# Altium schematic sheet High_Voltage_Driver.SchDoc
size A; CompanyName: Microchip Technology Inc.; Organization: Microchip Technology; Address1: 2355 West Chandler Blvd.; Address2: Chandler, AZ  85224; Address4: USA; SheetNumber: 1; SheetTotal: 1; Time: Time
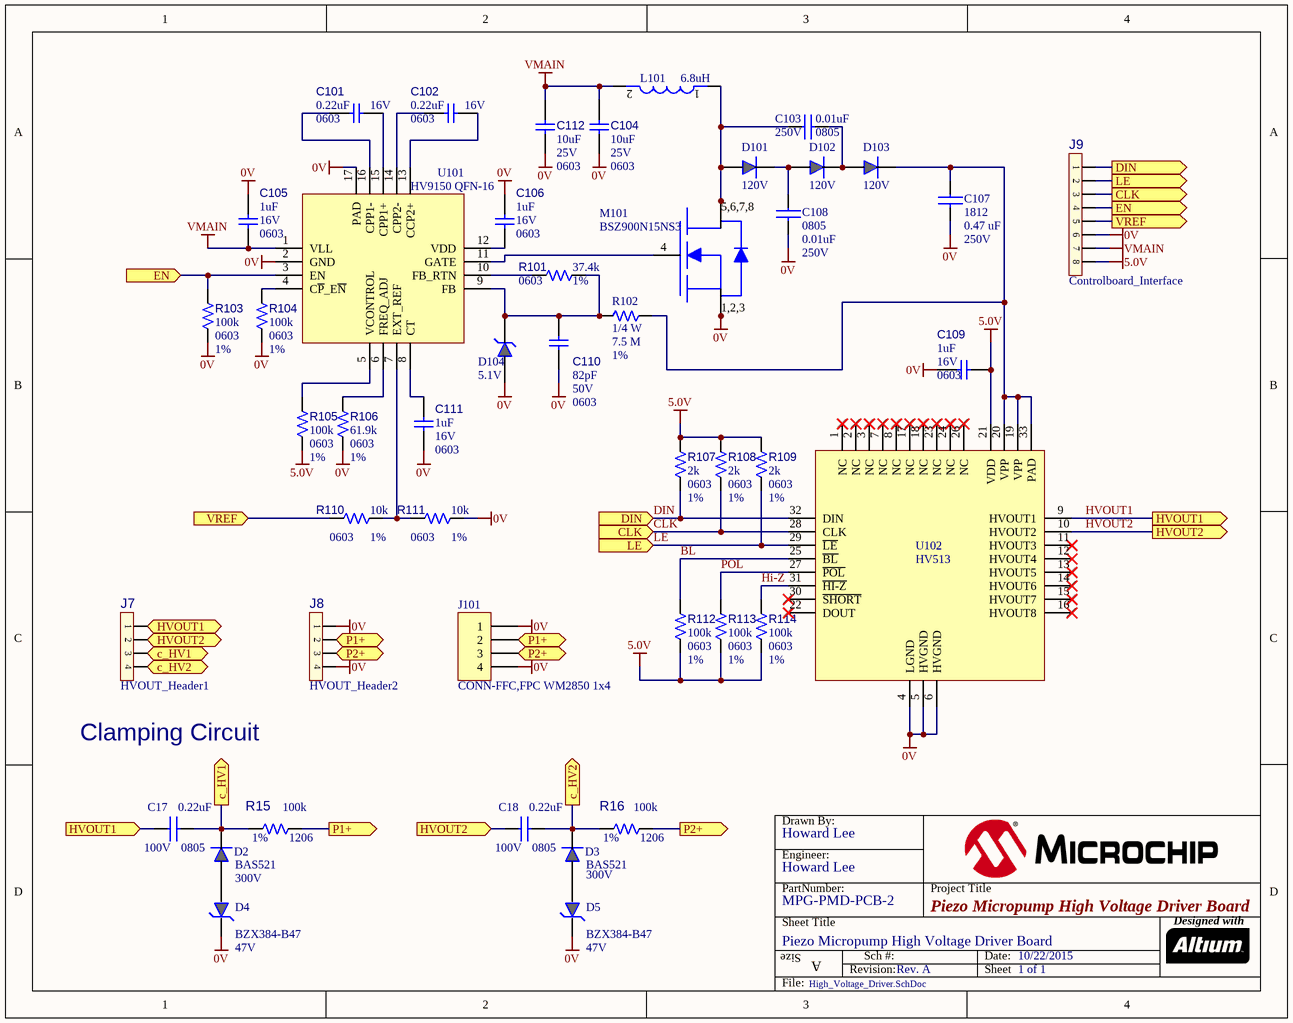
[diagram p0: High_Voltage_Driver.SchDoc]

## Parts
?  (no value)  (graphical)
C17  value 0.22uF  Voltage: 100V  [0805]  (hidden comment: Capacitor 0.22uF 100V 0805)
C18  value 0.22uF  Voltage: 100V  [0805]  (hidden comment: Capacitor 0.22uF 100V 0805)
C101  value 0.22uF  Voltage: 16V  Package: 0603  [CAP_C_0603]  (hidden comment: Capacitor NP)
C102  value 0.22uF  Voltage: 16V  Package: 0603  [CAP_C_0603]  (hidden comment: Capacitor NP)
C103  value 0.01uF  Voltage: 250V  [0805]  (hidden comment: Capacitor 0.01uF 250V 0805)
C104  value 10uF  Voltage: 25V  Package: 0603  [CAP_C_0603]  (hidden comment: Capacitor NP)
C105  value 1uF  Voltage: 16V  Package: 0603  [CAP_C_0603]  (hidden comment: Capacitor NP)
C106  value 1uF  Voltage: 16V  Package: 0603  [CAP_C_0603]  (hidden comment: Capacitor NP)
C107  value 0.47 uF  Voltage: 250V  [1812]  (hidden comment: Capacitor 0.47uF 250V 1812)
C108  value 0.01uF  Voltage: 250V  [0805]  (hidden comment: Capacitor 0.01uF 250V 0805)
C109  value 1uF  Voltage: 16V  Package: 0603  [CAP_C_0603]  (hidden comment: Capacitor NP)
C110  value 82pF  Voltage: 50V  Package: 0603  [CAP_C_0603]  (hidden comment: Capacitor NP)
C111  value 1uF  Voltage: 16V  Package: 0603  [CAP_C_0603]  (hidden comment: Capacitor NP)
C112  value 10uF  Voltage: 25V  Package: 0603  [CAP_C_0603]  (hidden comment: Capacitor NP)
D2  Part Number: BAS521  [SC-79]  (hidden comment: 300V)
D3  Part Number: BAS521  [SC-79]  (hidden comment: 300V)
D4  Part Number: BZX384-B47  [SOD-323]  (hidden comment: 47V)
D5  Part Number: BZX384-B47  [SOD-323]  (hidden comment: 47V)
D101  120V  [SOD-923]
D102  120V  [SOD-923]
D103  120V  [SOD-923]
D104  5.1V  [SSSMini2-F4-B]
J7  HVOUT_Header1  [HDR_F_2.54_1x4_RA]
J8  HVOUT_Header2  [HDR_F_2.54_1x4_RA]
J9  Controlboard_Interface  [HDR_F_2.54_1x8_RA]
J101  CONN-FFC,FPC WM2850 1x4  [FFC - MOLEX 0039532044]
L101  Inductance: 6.8uH  [Inductor-W-0.1uH]  (hidden comment: Inductor 6.8uH  Wurth WE LHMI)
M101  BSZ900N15NS3  [PG-TSDSON-8]
R15  value 100k  Package: 1206  Tolerance: 1%  [RES_C_1206]  (hidden comment: Resistor)
R16  value 100k  Package: 1206  Tolerance: 1%  [RES_C_1206]  (hidden comment: Resistor)
R101  value 37.4k  Package: 0603  Tolerance: 1%  [RES_C_0603]  (hidden comment: Resistor)
R102  value 7.5 M  Power: 1/4 W  Tolerance: 1%  [RES 7.5M SMD 1206]  (hidden comment: 1206 500V Resistor)
R103  value 100k  Package: 0603  Tolerance: 1%  [RES_C_0603]  (hidden comment: Resistor)
R104  value 100k  Package: 0603  Tolerance: 1%  [RES_C_0603]  (hidden comment: Resistor)
R105  value 100k  Package: 0603  Tolerance: 1%  [RES_C_0603]  (hidden comment: Resistor)
R106  value 61.9k  Package: 0603  Tolerance: 1%  [RES_C_0603]  (hidden comment: Resistor)
R107  value 2k  Package: 0603  Tolerance: 1%  [RES_C_0603]  (hidden comment: Resistor)
R108  value 2k  Package: 0603  Tolerance: 1%  [RES_C_0603]  (hidden comment: Resistor)
R109  value 2k  Package: 0603  Tolerance: 1%  [RES_C_0603]  (hidden comment: Resistor)
R110  value 10k  Package: 0603  Tolerance: 1%  [RES_C_0603]  (hidden comment: Resistor)
R111  value 10k  Package: 0603  Tolerance: 1%  [RES_C_0603]  (hidden comment: Resistor)
R112  value 100k  Package: 0603  Tolerance: 1%  [RES_C_0603]  (hidden comment: Resistor)
R113  value 100k  Package: 0603  Tolerance: 1%  [RES_C_0603]  (hidden comment: Resistor)
R114  value 100k  Package: 0603  Tolerance: 1%  [RES_C_0603]  (hidden comment: Resistor)
U101  HV9150 QFN-16  [QFN-16(3X3)]
U102  HV513  [QFN-32(6X6)]

## Ports
c_HV1 (in), c_HV1 (out), c_HV2 (in), c_HV2 (out), CLK (in), CLK (out), DIN (in), DIN (out), EN (in), EN (out), HVOUT1 (in), HVOUT1 (out), HVOUT2 (in), HVOUT2 (out), LE (in), LE (out), P1+ (in), P1+ (out), P2+ (in), P2+ (out), VREF (in), VREF (out)

## Nets
0V: C104.1 C105.2 C106.2 C107.2 C108.2 C109.1 C110.1 C111.1 C112.1 D4.1 D5.1 D104.2 J8.1 J8.4 J9.6 J101.1 J101.4 M101.1 M101.2 M101.3 R103.1 R104.1 R106.1 R111.1 U101.2(GND) U101.17(PAD) U102.4(LGND) U102.5(HVGND) U102.6(HVGND)
5.0V: C109.2 J9.8 R105.1 R107.2 R108.2 R109.2 R112.2 R113.1 R114.1 U102.21(VDD)
VMAIN: C104.2 C105.1 C112.2 J9.7 L101.2 U101.1(VLL)
BL: R112.1 U102.25(~{BL})
c_HV1: C17.2 D2.1 J7.3 R15.1 ; port c_HV1
c_HV2: C18.2 D3.1 J7.4 R16.1 ; port c_HV2
CLK: J9.3 R108.1 U102.28(CLK) ; port CLK
DIN: J9.1 R107.1 U102.32(DIN) ; port DIN
EN: J9.4 R103.2 U101.3(EN) ; port EN
Hi-Z: R114.2 U102.31(~{HI-Z})
HVOUT1: C17.1 J7.1 U102.9(HVOUT1) ; port HVOUT1
HVOUT2: C18.1 J7.2 U102.10(HVOUT2) ; port HVOUT2
LE: J9.2 R109.1 U102.29(~{LE}) ; port LE
P1+: J8.2 J101.2 R15.2 ; port P1+
P2+: J8.3 J101.3 R16.2 ; port P2+
POL: R113.2 U102.27(~{POL})
VREF: J9.5 R110.1 ; port VREF
NetC101_1: C101.1 U101.15(CPP1+)
NetC101_2: C101.2 U101.16(CPP1-)
NetC102_1: C102.1 U101.14(CPP2-)
NetC102_2: C102.2 U101.13(CCP2+)
NetC103_1: C103.1 D101.2 L101.1 M101.5 M101.6 M101.7 M101.8
NetC103_2: C103.2 D102.1 D103.2
NetC106_1: C106.1 U101.12(VDD)
NetC107_1: C107.1 D103.1 R102.2 U102.19(VPP) U102.20(VPP) U102.33(PAD)
NetC108_1: C108.1 D101.1 D102.2
NetC110_2: C110.2 D104.1 R101.2 R102.1 U101.9(FB)
NetC111_2: C111.2 U101.8(CT)
NetD2_2: D2.2 D4.2
NetD3_2: D3.2 D5.2
NetM101_4: M101.4 U101.11(GATE)
NetR101_1: R101.1 U101.10(FB_RTN)
NetR104_2: R104.2 U101.4(C~{P}_E~{N})
NetR105_2: R105.2 U101.5(VCONTROL)
NetR106_2: R106.2 U101.6(FREQ_ADJ)
NetR110_2: R110.2 R111.2 U101.7(EXT_REF)

Not connected (* = marked no-connect by the designer): U102 1(NC)* 2(NC)* 3(NC)* 7(NC)* 8(NC)* 11(HVOUT3)* 12(HVOUT4)* 13(HVOUT5)* 14(HVOUT6)* 15(HVOUT7)* 16(HVOUT8)* 17(NC)* 18(NC)* 22(DOUT)* 23(NC)* 24(NC)* 26(NC)* 30(~{SHORT})*

## Notes on the sheet
- Clamping Circuit
- Drawn By:
- Howard Lee
- Engineer:
- MPG-PMD-PCB-2
- PartNumber:
- Piezo Micropump High Voltage Driver Board
- Project Title
- Sheet Title
- Size
- A
- Revision:
- Sch #:
- Rev. A
- Date:
- Sheet
- 10/22/2015
- Designed with
- File:
- (in symbol BSZ900N15NS3) 5,6,7,8; 1,2,3

## Library data of the parts
? = Title Block A
C17 C18 = Capacitor 0.22uF 100V 0805: Manufacturer1: Kemet; Part Number: C0805C224K1RACAUTO; Type: Ceramic; Tolerance: +/-10%; Manufacturer: Kemet; PackageDescription: Chip Package; Supplier 1: Digikey; Supplier Part Number 1: 399-6946-1-ND; Package: 0805
C101 C102 = CAP1295: Capacitor; Manufacturer 1: TDK Corporation; Manufacturer Part Number 1: C1608X7R1C224K080AC; Description_: CAP CER 0.22uF 16V 10% X7R SMD 0603; Tolerance: 10%; Temperature Coeffcient: X7R; Type: Ceramic; Owner: Jairuz Agang-ang; Populated: YES; MCHP-ID: CAP1295; Revision: 1; Status: Production; ComponentLink1URL: https://chn-vm-apps.microchip.com/mchprepo/parts/Datasheets/mlccspec_commercial_general_midvoltage_en.pdf; ComponentLink1Description: Datasheet; Operating Temperature: -55C to +125C; Category: Capacitor; Supplier 1: Digi-Key; Supplier Part Number 1: 445-1318-1-ND; Quantity Override: 1
C103 C108 = Capacitor 0.01uF 250V 0805: Manufacturer1: TDK; Part Number: C2012X7R2E103K125AA; Type: Ceramic; Manufacturer: TDK; PackageDescription: Chip Package; Supplier 1: Digikey; Supplier Part Number 1: 445-2280-1-ND; Package: 0805
C104 C112 = CAP1461: Capacitor; Manufacturer 1: Murata Electronics North America; Manufacturer Part Number 1: GRM188R61E106MA73D; Description_: CAP CER 10UF 25V 20% X5R SMD 0603; Tolerance: ±20%; Temperature Coeffcient: X5R; Type: Ceramic; Owner: Tim Moffat; Populated: YES; MCHP-ID: CAP1461; Revision: 1; Status: Production; ComponentLink1URL: https://chn-vm-apps.microchip.com/mchprepo/parts/Datasheets/GRM188R61E106MA73-01.pdf; ComponentLink1Description: Datasheet; Operating Temperature: -55C to 85C; Category: Capacitor; Supplier 1: Digi-Key; Supplier Part Number 1: 490-7202-1-ND; Quantity Override: 1
C105 C106 C109 C111 = CAP0517: Capacitor; Manufacturer 1: Taiyo Yuden; Manufacturer Part Number 1: EMK107B7105KA-T; Description_: CAP CER 1uF 16V 10% X7R SMD 0603; Tolerance: 10%; Temperature Coeffcient: X7R; Type: Ceramic; Populated: Yes; MCHP-ID: CAP0517; Revision: 1; Status: Production; ComponentLink1URL: https://chn-vm-apps.microchip.com/mchprepo/parts/Datasheets/mlcc01_e.pdf; ComponentLink1Description: Datasheet; Operating Temperature: -55C to +125C; Category: Capacitor; Manufacturer 2: TDK; Manufacturer Part Number 2: C1608X7R1C105K; Supplier 1: Digi-Key; Supplier Part Number 1: 587-1241-1-ND; Supplier 2: Digi-Key; Supplier Part Number 2: 445-1604-1-ND; Quantity Override: 1
C107 = Capacitor 0.47uF 250V 1812: Manufacturer1: Murata; Part Number: GRM43DR72E474KW01L; Type: Ceramic; Manufacturer: Murata; PackageDescription: Chip Package; Supplier 1: Digikey; Supplier Part Number 1: 490-3549-6-ND; Package: 1812
C110 = CAP1424: Capacitor; Manufacturer 1: Murata Electronics North America; Manufacturer Part Number 1: GRM1885C1H820JA01D; Description_: CAP CER 82pF 50V 5% NP0 SMD 0603; Tolerance: 5%; Temperature Coeffcient: NP0; Type: Ceramic; Owner: Tad Ahlvers; Populated: YES; MCHP-ID: CAP1424; Revision: B; Status: Design; ComponentLink1URL: https://chn-vm-apps.microchip.com/mchprepo/parts/Datasheets/GRM1885C1H820JA01-01.pdf; ComponentLink1Description: Datasheet; Operating Temperature: -55C to +125C; Category: Capacitor; Supplier 1: Digi-Key; Supplier Part Number 1: 490-1425-1-ND; Quantity Override: 1
D2 D3 = Diode-BAS521-50ns-300V: BAS521- Single high-voltage switching diode 300V; Manufacturer: NXP Semiconductors; LeadCount: 2; TempRange: -65C to  150C; Reverse recovery time: 50ns; Forward Current: 250mA; Package: SC-79; PackageType: SC-79; Power: -; Supplier 1: Digikey; Supplier Part Number 1: 568-6009-1-ND; Voltage: 300V
D4 D5 = ZenerDiode-47V: Zener Diode 47V - BZX384-B47 - Voltage regulator diode +/-2%; Manufacturer: NXP Semiconductors; LeadCount: 2; Power: 300mW; TempRange: -65C to  150C; Forward Current: 250mA; Package: SOD-323; PackageType: SOD-323; Tolerance: +/-2%; Supplier 1: Digikey; Supplier Part Number 1: 568-3830-1-ND; Reverse recovery time: -; Voltage: 47V
D101-D103 = Diode-Ultra Fast Speed-4ns-120V: Manufacturer: Central Semiconductro Corp; Part Number: CMAD4448 CT-ND; LeadCount: 2; TempRange: -65C to  150C; Tolerance: +/- 5%; Package: SOD-923; PackageType: SOD-923; Power: -; Voltage: 120V; Supplier 1: Digikey; Supplier Part Number 1: CMAD4448 CT-ND
D104 = ZenerDiode_5.1V [SSSMini2-F4-B]: ZenerDiode 5.1V; Manufacturer: Micro Commercial Co; Part Number: DZ2705100LTR-ND; LeadCount: 2; Power: 120mW; TempRange: -40C to  85C; Tolerance: +/- 5%; Package: SSSMini2-F4-B; PackageType: 2-SMD; Voltage: 5.1V; Supplier 1: Digikey; Supplier Part Number 1: DZ2705100LTR-ND
J7 J8 = CON1287: Manufacturer 1: Samtec Inc; Manufacturer Part Number 1: SSW-104-02-G-S-RA; Value: HDR-2.54 Female 1x4; Description_: CON HDR-2.54 Female 1x4 Gold TH R/A; Owner: Bogdan Popescu; Populated: YES; MCHP-ID: CON1287; Revision: A; Status: Design; ComponentLink1URL: https://chn-vm-apps.microchip.com/mchprepo/parts/Datasheets/SSW-1XX-XX-XXX-X-XX-XXX-XX-MKT.pdf; ComponentLink1Description: Datasheet; Type: Header 2.54mm; Category: Connector; Supplier 1: Digi-Key; Supplier Part Number 1: SAM1225-04-ND; Quantity Override: 1
J9 = CON1288: Manufacturer 1: Sullins Connector Solutions; Manufacturer Part Number 1: PPPC081LGBN-RC; Value: HDR-2.54 Female 1x8; Description_: CON HDR-2.54 Female 1x8 Gold TH R/A; Owner: Bogdan Popescu; Populated: YES; MCHP-ID: CON1288; Revision: A; Status: Design; ComponentLink1URL: https://chn-vm-apps.microchip.com/mchprepo/parts/Datasheets/78_P(N)PxCxx1LGBN-RC,_10493-F.pdf; ComponentLink1Description: Datasheet; Type: Header 2.54mm; Category: Connector; Supplier 1: Digi-Key; Supplier Part Number 1: S5483-ND; Quantity Override: 1
J101 = CONN-FFC,FPC TOP4POS 1.25MM RA 1x4: Manufacturer1: MOLEX; Part Number: 0039532044; LeadCount: 4; Category: MCHP-Analog; PackageType: Flat Flex Connnector; Manufacturer: MOLEX; Supplier: Digikey; Supplier 1: Digikey; Supplier Part Number 1: WM2850-ND
L101 = Inductor 6.8uH  Wurth WE LHMI: Inductor-6.8uH Wurth WE LHMI SMD Low Profile High Current Molded Inductor; Part Number: 744 373 240 68; Manufacturer: Wurth Elektronik
M101 = BSZ900N15NS3: Power Transistor-150V; Manufacturer1: Infineon Technologies; Part Number: BSZ900N15NS3 GTR-ND; Voltage: 150V; Manufacturer: Infineon Technologies; Operating Temperature: -55 to +150 C; Package: 8-PowerTDFN; PackageType: PG-TSDSON-8; Supplier 1: Digikey; Supplier Part Number 1: BSZ900N15NS3 GTR-ND
R15 R16 = RES1231: Manufacturer 1: Panasonic; Manufacturer Part Number 1: ERJ-8ENF1003V; Description_: RES TKF 100k 1% 1/4W SMD 1206; Voltage: 200V; Temperature Coeffcient: 100ppm/C; Power: 1/4W; Owner: Bogdan P (M91398); Populated: Yes; MCHP-ID: RES1231; Revision: 0; Status: Production; ComponentLink1URL: https://chn-vm-apps.microchip.com/mchprepo/parts/Datasheets/AOA0000CE2.pdf; ComponentLink1Description: Datasheet; Operating Temperature: -55C to +155C; Category: Resistor; Type: RES SMD; Composition: TKF; Supplier 1: Digi-Key; Supplier Part Number 1: P100KFCT-ND; Quantity Override: 1
R101 = RSMT0489: Manufacturer 1: Panasonic; Manufacturer Part Number 1: ERJ-3EKF3742V; Description_: RES TKF 37.4k 1% 1/10W SMD 0603; Voltage: 75V; Temperature Coeffcient: 100ppm/C; Power: 1/10W; Populated: Yes; MCHP-ID: RSMT0489; Revision: 1; Status: Production; ComponentLink1URL: https://chn-vm-apps.microchip.com/mchprepo/parts/Datasheets/AOA0000CE2.pdf; ComponentLink1Description: Datasheet; Operating Temperature: -55C to +155C; Category: Resistor; Type: RES SMD; Composition: TKF; Supplier 1: Digi-Key; Supplier Part Number 1: P37.4KHTR-ND; Quantity Override: 1
R102 = Resistor-7.5M_[1206]: Resistor-7.5M; Manufacturer: ROHM Semiconductors; Part Number: RHM 7.5M AICT-ND; Temperature Coefficient: +/- 100ppm/C; Suplier1: Digi-Key; PackageDescription: Chip Package; Voltage: 500V; Package: 1206; Type: RES SMD; Operating Temperature: -55 to +155 C; Supplier 1: Digikey; Supplier Part Number 1: RHM 7.5M AICT-ND
R103-R105 R112-R114 = RES1066: Manufacturer 1: Vishay; Manufacturer Part Number 1: MCT06030C1003FP500; Description_: RES TF 100k 1% 1/8W SMD 0603; Voltage: 75V; Temperature Coeffcient: 50ppm/C; Power: 1/8W; Owner: Tad Ahlvers; Populated: Yes; MCHP-ID: RES1066; Revision: 1; Status: Production; ComponentLink1URL: https://chn-vm-apps.microchip.com/mchprepo/parts/Datasheets/mc_pro.pdf; ComponentLink1Description: Datasheet; Operating Temperature: -55C to +155C; Category: Resistor; Type: RES SMD; Composition: TF; Supplier 1: Digi-Key; Supplier Part Number 1: MCT0603-100K-CFTR-ND; Quantity Override: 1
R106 = RSMT0411: Manufacturer 1: Panasonic; Manufacturer Part Number 1: ERJ-3EKF6192V; Description_: RES TKF 61.9k 1% 1/10W SMD 0603; Voltage: 75V; Temperature Coeffcient: 100ppm/C; Power: 1/10W; Populated: Yes; MCHP-ID: RSMT0411; Revision: 1; Status: Production; ComponentLink1URL: https://chn-vm-apps.microchip.com/mchprepo/parts/Datasheets/AOA0000CE2.pdf; ComponentLink1Description: Datasheet; Operating Temperature: -55C to +155C; Category: Resistor; Type: RES SMD; Composition: TKF; Manufacturer 2: ROHM; Manufacturer Part Number 2: MCR03EZPFX6192; Manufacturer 3: Stackpole Electronics Inc; Manufacturer Part Number 3: RMCF 1/16 61.9K 1% R; Manufacturer 4: Stackpole Electronics Inc; Manufacturer Part Number 4: RMCF0603FT61K9; Supplier 1: Digi-Key; Supplier Part Number 1: P61.9KHCT-ND; Supplier 2: Digi-Key; Supplier Part Number 2: RHM61.9KHCT-ND; Supplier 3: Digi-Key; Supplier Part Number 3: RMCF0603FT61K9TR-ND; Supplier 4: Digi-Key; Supplier Part Number 4: RMCF1/1661.9KFRTR-ND; Quantity Override: 1
R107-R109 = RSMT0382: Manufacturer 1: Panasonic; Manufacturer Part Number 1: ERJ-3EKF2001V; Description_: RES TKF 2k 1% 1/10W SMD 0603; Voltage: 75V; Temperature Coeffcient: 100ppm/C; Power: 1/10W; Populated: Yes; MCHP-ID: RSMT0382; Revision: 1; Status: Production; ComponentLink1URL: https://chn-vm-apps.microchip.com/mchprepo/parts/Datasheets/AOA0000CE2.pdf; ComponentLink1Description: Datasheet; Operating Temperature: -55C to +155C; Category: Resistor; Type: RES SMD; Composition: TKF; Supplier 1: Digi-Key; Supplier Part Number 1: P2.00KHTR-ND; Supplier 2: Digi-Key; Supplier Part Number 2: P2.00KHCT-ND; Quantity Override: 1
R110 R111 = RES1368: Manufacturer 1: TE Connectivity; Manufacturer Part Number 1: 5-1879337-9; Description_: RES TF 10k 1% 1/16W SMD 0603; Voltage: 100V; Temperature Coeffcient: 50ppm/C; Circuit Type: Isolated; Power: 1/16W; Owner: Jairuz Agang-ang; Populated: YES; MCHP-ID: RES1368; Revision: 1; Status: Production; ComponentLink1URL: https://chn-vm-apps.microchip.com/mchprepo/parts/Datasheets/ENG_DS_1773200_H.pdf; ComponentLink1Description: Datasheet; Operating Temperature: -55C to +155C; Category: Resistor; Type: RES SMD; Composition: TF; Supplier 1: Digi-Key; Supplier Part Number 1: A102203CT-ND; Quantity Override: 1
U101 = HV9150 QFN-16: Manufacturer1: Microchip; LeadCount: 16; Category: MCHP-Analog; PackageType: QFN; Manufacturer: Microchip
U102 = HV513 QFN-32: Manufacturer1: Microchip; LeadCount: 32; Category: MCHP-Analog; PackageType: QFN; Manufacturer: Microchip